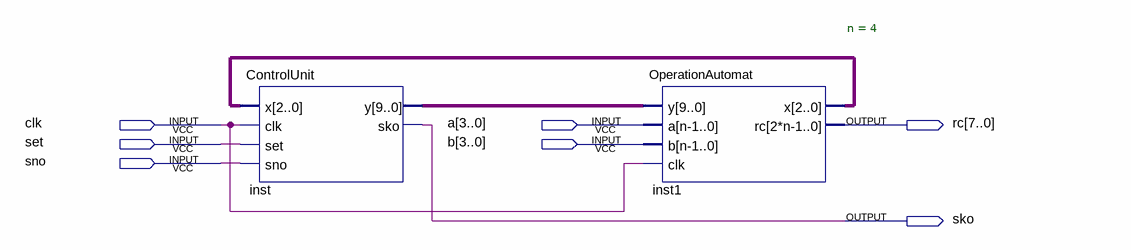
[diagram p0: schematic sheet]
// Quartus schematic multiply_scheme.bdf as structural Verilog: 2 symbols, 7 pins
module multiply_scheme (
  input  clk,
  input  [3:0] a,
  input  set,
  input  [3:0] b,
  input  sno,
  output [7:0] rc,
  output sko
);

  wire [2:0] inst1_x;
  wire [9:0] inst_y;

  ControlUnit inst (.x(inst1_x), .clk(clk), .set(set), .sno(sno), .y(inst_y), .sko(sko));
  OperationAutomat #(.n(4)) inst1 (.y(inst_y), .a(a), .b(b), .clk(clk), .x(inst1_x), .rc(rc));
endmodule
